# Altium schematic sheet PROTECTION.SchDoc
size A4; SheetNumber: 1; SheetTotal: 4
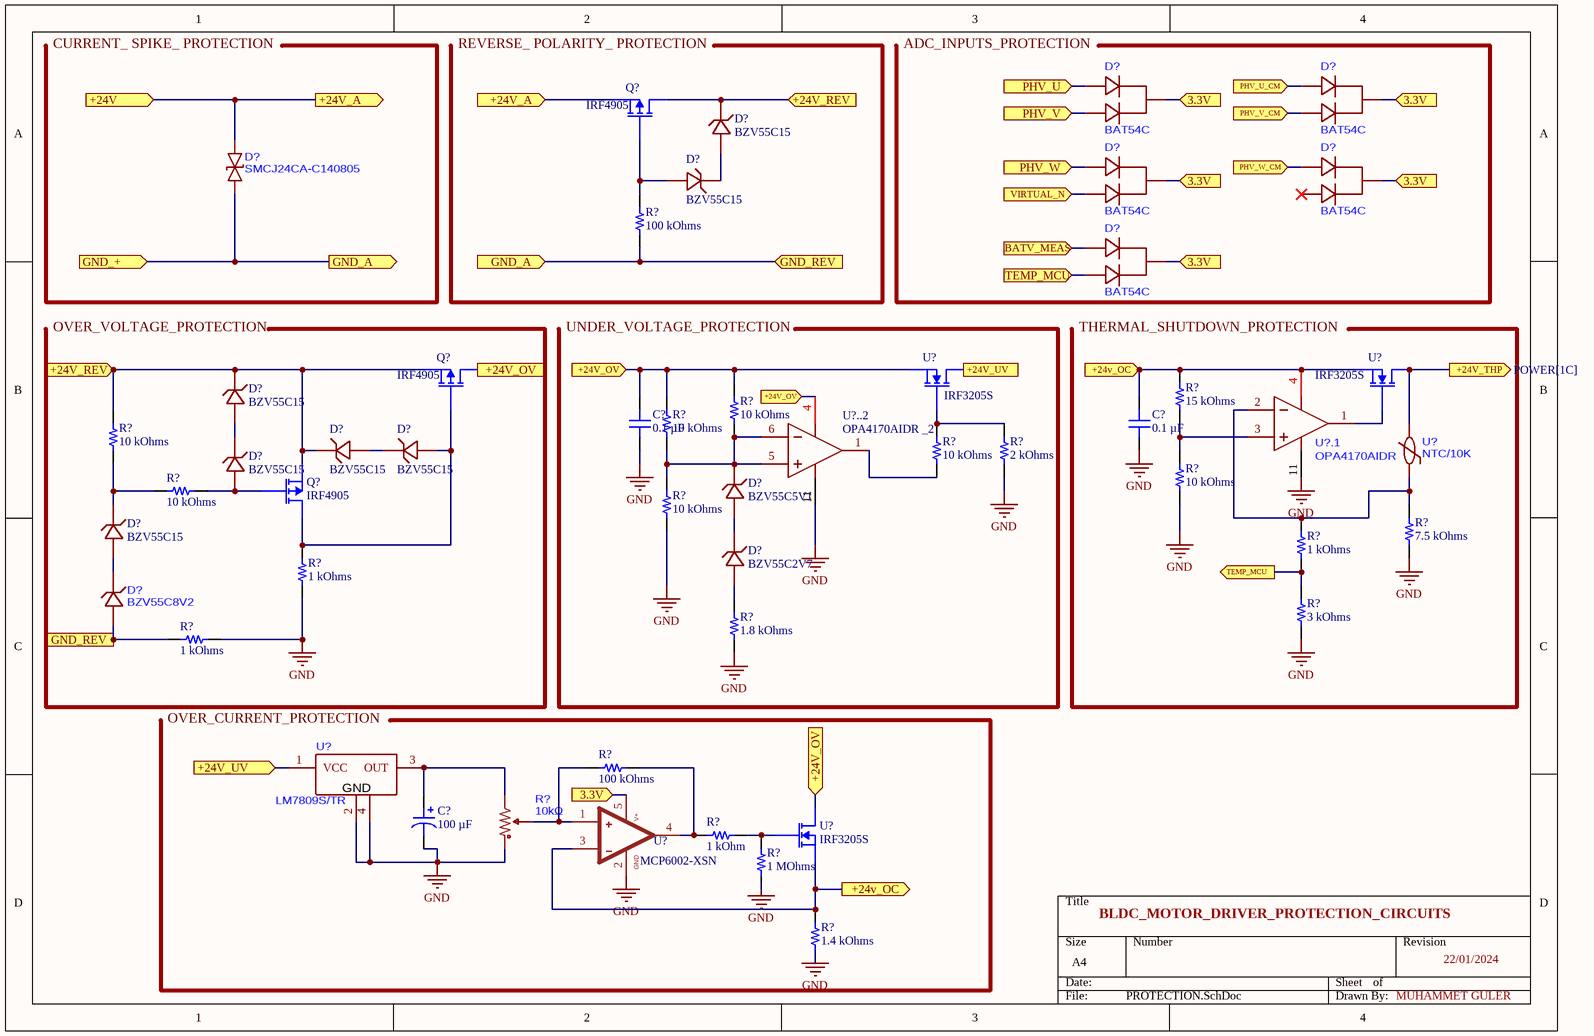
[diagram p0: PROTECTION.SchDoc]

## Parts
(Parts that share a designator on the sheet are numbered #1, #2 ... from top to bottom, then left to right.)
C?#1  0.1 µF  [CAP 1210_3225 - 1MM]
C?#2  0.1 µF  [CAP 1210_3225 - 1MM]
C?#3  100 µF  [CAP ALSMD POLY 5.3MM H5.7MM]
D?#1  BAT54C  [SOT-23-3_L2.9-W1.6-P1.90-LS2.8-BR]
D?#2  BAT54C  [SOT-23-3_L2.9-W1.6-P1.90-LS2.8-BR]
D?#3  BZV55C15  [SOD-80_L3.5-W1.5-RD]
D?#4  SMCJ24CA-C140805  [SMC_L6.9-W5.9-LS7.9-BI]
D?#5  BZV55C15  [SOD-80_L3.5-W1.5-RD]
D?#6  BAT54C  [SOT-23-3_L2.9-W1.6-P1.90-LS2.8-BR]
D?#7  BAT54C  [SOT-23-3_L2.9-W1.6-P1.90-LS2.8-BR]
D?#8  BAT54C  [SOT-23-3_L2.9-W1.6-P1.90-LS2.8-BR]
D?#9  BZV55C15  [SOD-80_L3.5-W1.5-RD]
D?#10  BZV55C15  [SOD-80_L3.5-W1.5-RD]
D?#11  BZV55C15  [SOD-80_L3.5-W1.5-RD]
D?#12  BZV55C15  [SOD-80_L3.5-W1.5-RD]
D?#13  BZV55C5V1  [SOD-80_L3.5-W1.5-RD]
D?#14  BZV55C15  [SOD-80_L3.5-W1.5-RD]
D?#15  BZV55C2V7  [SOD-80_L3.5-W1.5-RD]
D?#16  BZV55C8V2  [SOD-80_L3.5-W1.5-RD]
Q?#1  IRF4905  [IRF4905]
Q?#2  IRF4905  [IRF4905]
Q?#3  IRF4905  [IRF4905]
R?#1  100 kOhms  [RES 1210_3225]
R?#2  15 kOhms  [RES 1210_3225]
R?#3  10 kOhms  [RES 1210_3225]
R?#4  10 kOhms  [RES 1210_3225]
R?#5  10 kOhms  [RES 1210_3225]
R?#6  10 kOhms  [RES 1210_3225]
R?#7  2 kOhms  [RES 1210_3225]
R?#8  10 kOhms  [RES 1210_3225]
R?#9  10 kOhms  [RES 1210_3225]
R?#10  10 kOhms  [RES 1210_3225]
R?#11  7.5 kOhms  [RES 1210_3225]
R?#12  1 kOhms  [RES 1210_3225]
R?#13  1 kOhms  [RES 1210_3225]
R?#14  3 kOhms  [RES 1210_3225]
R?#15  1.8 kOhms  [RES 1210_3225]
R?#16  1 kOhms  [RES 1210_3225]
R?#17  100 kOhms  [RES 1210_3225]
R?#18  10kΩ
R?#19  1 kOhm  [RES 1210_3225]
R?#20  1 MOhms  [RES 1210_3225]
R?#21  1.4 kOhms  [RES 1210_3225]
U?#1  IRF3205S  [IRF4905]
U?#2  IRF3205S  [IRF4905]
U?#3  NTC/10K  [R1210]
U?#4  LM7809S/TR  [TO-263-3_LM7809]
U?#5  MCP6002-XSN  [MSOP-8_MCP6002-XSN]
U?#6  IRF3205S  [IRF4905]
U?.1  OPA4170AIDR  [SOIC-14_OPA4170]
U?..2  OPA4170AIDR _2  [SOIC-14_OPA4170]

## Ports
3.3V (in, see DRIVER[3A], DRIVER[4B], MCU[1B], MCU[1C], MCU[1D], MCU[2A], MCU[2B], MCU[2C], MCU[2D], MCU[3A], MCU[3B], MCU[3D], MCU[4A], MCU[4C], POWER[2A], POWER[3A], POWER[3B], POWER[4A], PROTECTION[2D], PROTECTION[4A]), 3.3V (in, see DRIVER[3A], DRIVER[4B], MCU[1B], MCU[1C], MCU[1D], MCU[2A], MCU[2B], MCU[2C], MCU[2D], MCU[3A], MCU[3B], MCU[3D], MCU[4A], MCU[4C], POWER[2A], POWER[3A], POWER[3B], POWER[4A], PROTECTION[2D], PROTECTION[4A], PROTECTION[4B]), 3.3V (in, see DRIVER[3A], DRIVER[4B], MCU[1B], MCU[1C], MCU[1D], MCU[2A], MCU[2B], MCU[2C], MCU[2D], MCU[3A], MCU[3B], MCU[3D], MCU[4A], MCU[4C], POWER[2A], POWER[3A], POWER[3B], POWER[4A], PROTECTION[4A], PROTECTION[4B]), +24V (in, see POWER[4C]), +24V_A (in, see PROTECTION[1A]), +24V_A (out, see PROTECTION[2A]), +24v_OC (in, see POWER[1C], POWER[2C], PROTECTION[3D]), +24v_OC (out, see POWER[1C], POWER[2C], PROTECTION[3B]), +24V_OV (in, see PROTECTION[2B]), +24V_OV (in, see PROTECTION[2B], PROTECTION[3D]), +24V_OV (out, see PROTECTION[2B], PROTECTION[3D]), +24V_REV (in, see PROTECTION[1B]), +24V_REV (in, see PROTECTION[3A]), +24V_THP (out, see POWER[1C]), +24V_UV (in, see PROTECTION[1C]), +24V_UV (in, see PROTECTION[3B]), BATV_MEAS (in), GND_+ (in), GND_A (in, see PROTECTION[1B]), GND_A (out, see PROTECTION[2B]), GND_REV (in, see PROTECTION[1C]), GND_REV (in, see PROTECTION[2B]), PHV_U (in, see DRIVER[2A], DRIVER[3B], MCU[2B]), PHV_U_CM (in, see MCU[2B], POWER[3A]), PHV_V (in, see DRIVER[3B], DRIVER[4A], MCU[2B]), PHV_V_CM (in, see MCU[2B], POWER[3B]), PHV_W (in, see DRIVER[3B], DRIVER[4B], MCU[2B]), PHV_W_CM (in, see MCU[2B], POWER[4A]), TEMP_MCU (in, see MCU[3B], PROTECTION[4C]), TEMP_MCU (out, see MCU[3B], PROTECTION[3B]), VIRTUAL_N (in, see DRIVER[2A], DRIVER[2B], DRIVER[4A], DRIVER[4B], MCU[2B])

## Nets
GND: C?#1.2 C?#2.2 C?#3.2 R?#7.2 R?#8.2 R?#10.2 R?#11.2 R?#13.2 R?#14.2 R?#15.2 R?#16.1 R?#18.2 R?#20.2 R?#21.2 U?#4.2(GND) U?#4.4(GND) U?#5.2(GND) U?.1.11(V-) U?..2.11(V-)
3.3V: D?#1.3(K) D?#2.3(K) D?#6.3(K) D?#7.3(K) D?#8.3(K) U?#5.5(V+) ; port 3.3V
+24V: D?#4.1 Q?#1.3(S) ; port +24V, port +24V_A
+24v_OC: C?#2.1 R?#2.1 R?#21.1 U?#2.3(S) U?#5.3(-) U?#6.3(S) U?.1.4(V+) ; port +24v_OC
+24V_OV: C?#1.1 Q?#2.2(D) R?#3.1 R?#4.1 U?#1.3(S) U?#6.2(D) U?..2.4(V+) ; port +24V_OV
+24V_REV: D?#3.1(C) D?#9.1(C) D?#10.1(C) Q?#1.2(D) Q?#2.3(S) Q?#3.3(S) R?#5.1 ; port +24V_REV
+24V_THP: U?#2.2(D) U?#3.2 ; port +24V_THP
+24V_UV: U?#1.2(D) U?#4.1(VCC) ; port +24V_UV
BATV_MEAS: D?#8.1(A1) ; port BATV_MEAS
GND_+: D?#4.2 D?#16.2(A) R?#1.2 R?#16.2 ; port GND_+, port GND_A, port GND_REV
PHV_U: D?#1.1(A1) ; port PHV_U
PHV_U_CM: D?#2.1(A1) ; port PHV_U_CM
PHV_V: D?#1.2(A2) ; port PHV_V
PHV_V_CM: D?#2.2(A2) ; port PHV_V_CM
PHV_W: D?#6.1(A1) ; port PHV_W
PHV_W_CM: D?#7.1(A1) ; port PHV_W_CM
TEMP_MCU: D?#8.2(A2) R?#12.2 R?#14.1 ; port TEMP_MCU
VIRTUAL_N: D?#6.2(A2) ; port VIRTUAL_N
NetC?#3_1: C?#3.1 R?#18.1 U?#4.3(OUT)
NetD?#3_2: D?#3.2(A) D?#5.1(C)
NetD?#5_2: D?#5.2(A) Q?#1.1(G) R?#1.1
NetD?#9_2: D?#9.2(A) D?#12.1(C)
NetD?#10_2: D?#10.2(A) D?#11.1(C)
NetD?#11_2: D?#11.2(A) Q?#2.1(G) Q?#3.2(D) R?#13.1
NetD?#12_2: D?#12.2(A) Q?#3.1(G) R?#9.1
NetD?#13_1: D?#13.1(C) R?#3.2 R?#4.2 R?#10.1 U?..2.5(INB+) U?..2.6(INB-)
NetD?#13_2: D?#13.2(A) D?#15.1(C)
NetD?#14_1: D?#14.1(C) R?#5.2 R?#9.2
NetD?#14_2: D?#14.2(A) D?#16.1(C)
NetD?#15_2: D?#15.2(A) R?#15.1
NetR?#2_2: R?#2.2 R?#8.1 U?.1.3(INA+)
NetR?#6_1: R?#6.1 R?#7.1 U?#1.1(G)
NetR?#6_2: R?#6.2 U?..2.1(OUTA)
NetR?#11_1: R?#11.1 R?#12.1 U?#3.1 U?.1.2(INA-)
NetR?#17_1: R?#17.1 R?#18.3 U?#5.1(+)
NetR?#17_2: R?#17.2 R?#19.1 U?#5.4(OUT)
NetR?#19_2: R?#19.2 R?#20.1 U?#6.1(G)
NetU?#2_1: U?#2.1(G) U?.1.1(OUTA)

Not connected (* = marked no-connect by the designer): D?#7 2(A2)*

## Notes on the sheet
- CURRENT_ SPIKE_ PROTECTION
- (near Q?#1) REVERSE_ POLARITY_ PROTECTION
- ADC_INPUTS_PROTECTION
- OVER_VOLTAGE_PROTECTION
- UNDER_VOLTAGE_PROTECTION
- THERMAL_SHUTDOWN_PROTECTION
- (near U?#4) OVER_CURRENT_PROTECTION
- BLDC_MOTOR_DRIVER_PROTECTION_CIRCUITS
- 22/01/2024
- MUHAMMET GÜLER

## Library data of the parts
C?#1 C?#2 = CAN13X104KARAC7800: CAP CER 1210 0.1UF 250VAC X7R; manufacturer: KEMET; Tolerance: ±10%; Part Number: CAN13X104KARAC7800; Value: 0.1 µF; Applications: Boardflex Sensitive; Capacitance: 0.1 µF; componentlink1description: Datasheet; componentlink1url: //media.digikey.com/pdf/Data%20Sheets/Kemet%20PDFs/CAN13X104KARACTU_Spec.pdf; componentlink2description: DigiKey Link; componentlink2url: https://www.digikey.com/en/products/detail/kemet/CAN13X104KARAC7800/9962480; Device Package: 1210 (3225 Metric); Features: Soft Termination; lastupdated: 15.01.2024 20:41:47; Lifecycle Status: Active; Minimum Order: 1; Mounting Type: Surface Mount, MLCC; Operating Temperature: -55°C ~ 125°C; Package / Case: 1210 (3225 Metric); packaging: TapeAndReel; partid: 23615; Part Status: Active; price: 0.37; series: CAN SMD Indust X7R; Size / Dimension: 0.130" L x 0.102" W (3.30mm x 2.60mm); Supplier 1: DigiKey; Supplier Part Number 1: 399-20611-1-ND; Temperature Coefficient: X7R; Thickness (Max): 0.110" (2.80mm); Voltage - Rated: 250VAC
C?#3 = RFS0J101MCN1GS: CAP ALUM POLY 100UF 20% 6.3V SMD; manufacturer: Nichicon; ESR (Equivalent Series Resistance): 24mOhm; Lifetime @ Temp.: 2000 Hrs @ 105°C; Ripple Current @ High Frequency: 2.5 A @ 100 kHz; Ripple Current @ Low Frequency: 250 mA @ 120 Hz; Surface Mount Land Size: 0.209" L x 0.209" W (5.30mm x 5.30mm); Type: Polymer; Part Number: RFS0J101MCN1GS; Applications: General Purpose; Capacitance: 100 µF; componentlink1description: Datasheet; componentlink1url: http://nichicon-us.com/english/products/pdfs/e-rfs_rfa.pdf; componentlink2description: DigiKey Link; componentlink2url: https://www.digikey.com/en/products/detail/nichicon/RFS0J101MCN1GS/2202794; Device Package: Radial, Can - SMD; Height - Seated (Max): 0.224" (5.70mm); lastupdated: 13.01.2024 21:35:56; Lifecycle Status: Active; Minimum Order: 1; Mounting Type: Surface Mount; Operating Temperature: -55°C ~ 105°C; Package / Case: Radial, Can - SMD; packaging: TapeAndReel; partid: 1897; Part Status: Active; price: 0.25; series: FPCAP, RFS; Size / Dimension: 0.197" Dia (5.00mm); Supplier 1: DigiKey; Supplier Part Number 1: 493-3680-1-ND; Tolerance: ±20%; value: 100 µF; Voltage - Rated: 6.3 V
R?#1 R?#17 = RMCF1210FT100K: RES 100K OHM 1% 1/2W 1210; Manufacturer: Stackpole Electronics Inc; Power (Watts): 0.5W, 1/2W; Temperature Coefficient: ±100ppm/°C; Part Number: RMCF1210FT100K; ComponentLink1Description: Datasheet; ComponentLink1URL: https://www.seielect.com/catalog/sei-packaging.pdf; ComponentLink2Description: DigiKey Link; ComponentLink2URL: https://www.digikey.com/en/products/detail/stackpole-electronics-inc/RMCF1210FT100K/1758471; Composition: Thick Film; Device Package: 1210 (3225 Metric); Features: Automotive AEC-Q200; Height - Seated (Max): 0.028" (0.70mm); LastUpdated: 13.01.2024 21:51:14; Lifecycle Status: Active; Minimum Order: 1; Number of Terminations: 2; Operating Temperature: -55°C ~ 155°C; Package / Case: 1210 (3225 Metric); Packaging: TapeAndReel; Part Status: Active; Price: 0.01; Ratings: AEC-Q200; Resistance: 100 kOhms; Series: RMCF; Size / Dimension: 0.126" L x 0.098" W (3.20mm x 2.50mm); Supplier 1: DigiKey; Supplier Part Number 1: RMCF1210FT100KCT-ND; Supplier Device Package: 1210; Tolerance: ±1%; Value: 100 kOhms
R?#2 = CRCW121015K0FKEAHP: RES SMD 15K OHM 1% 3/4W 1210; Manufacturer: Vishay Dale; Power (Watts): 0.75W, 3/4W; Temperature Coefficient: ±100ppm/°C; Part Number: CRCW121015K0FKEAHP; ComponentLink1Description: Datasheet; ComponentLink1URL: http://www.vishay.com/docs/20043/crcwhpe3.pdf; ComponentLink2Description: DigiKey Link; ComponentLink2URL: https://www.digikey.com/en/products/detail/vishay-dale/CRCW121015K0FKEAHP/2567283; Composition: Thick Film; Device Package: 1210 (3225 Metric); Features: Automotive AEC-Q200, Pulse Withstanding; Height - Seated (Max): 0.028" (0.70mm); LastUpdated: 15.01.2024 21:47:36; Lifecycle Status: Active; Minimum Order: 1; Number of Terminations: 2; Operating Temperature: -55°C ~ 155°C; Package / Case: 1210 (3225 Metric); Packaging: TapeAndReel; Part Status: Active; Price: 0.13; Ratings: AEC-Q200; Resistance: 15 kOhms; Series: CRCW-HP; Size / Dimension: 0.126" L x 0.098" W (3.20mm x 2.50mm); Supplier 1: DigiKey; Supplier Part Number 1: 541-15.0KDCT-ND; Supplier Device Package: 1210; Tolerance: ±1%; Value: 15 kOhms
R?#3-R?#6 R?#8-R?#10 = RMCF1210FT10K0: RES 10K OHM 1% 1/2W 1210; Manufacturer: Stackpole Electronics Inc; Power (Watts): 0.5W, 1/2W; Temperature Coefficient: ±100ppm/°C; Part Number: RMCF1210FT10K0; ComponentLink1Description: Datasheet; ComponentLink1URL: https://www.seielect.com/catalog/sei-rmcf_rmcp.pdf; ComponentLink2Description: DigiKey Link; ComponentLink2URL: https://www.digikey.com/en/products/detail/stackpole-electronics-inc/RMCF1210FT10K0/1758528; Composition: Thick Film; Device Package: 1210 (3225 Metric); Features: Automotive AEC-Q200; Height - Seated (Max): 0.028" (0.70mm); Lifecycle Status: Active; Minimum Order: 1; Number of Terminations: 2; Operating Temperature: -55°C ~ 155°C; Package / Case: 1210 (3225 Metric); Packaging: TapeAndReel; Part Status: Active; Price: 0.01; Ratings: AEC-Q200; Resistance: 10 kOhms; Series: RMCF; Size / Dimension: 0.126" L x 0.098" W (3.20mm x 2.50mm); Supplier 1: DigiKey; Supplier Part Number 1: RMCF1210FT10K0CT-ND; Supplier Device Package: 1210; Tolerance: ±1%; Value: 10 kOhms
  R?#3 R?#4 R?#6 R?#10: LastUpdated: 16.01.2024 21:51:52
  R?#5 R?#9: LastUpdated: 13.01.2024 21:51:22
  R?#8: LastUpdated: 15.01.2024 21:47:42
R?#7 = RT1210BRD072KL: RES SMD 2K OHM 0.1% 1/4W 1210; Manufacturer: Yageo; Power (Watts): 0.25W, 1/4W; Temperature Coefficient: ±25ppm/°C; Part Number: RT1210BRD072KL; ComponentLink1Description: Datasheet; ComponentLink1URL: https://www.yageo.com/upload/media/product/productsearch/datasheet/rchip/PYu-RT_1-to-0.01_RoHS_L_11.pdf; ComponentLink2Description: DigiKey Link; ComponentLink2URL: https://www.digikey.com/en/products/detail/yageo/RT1210BRD072KL/5138742; Composition: Thin Film; Device Package: 1210 (3225 Metric); Height - Seated (Max): 0.026" (0.65mm); LastUpdated: 16.01.2024 21:51:50; Lifecycle Status: Active; Minimum Order: 1; Number of Terminations: 2; Operating Temperature: -55°C ~ 125°C; Package / Case: 1210 (3225 Metric); Packaging: TapeAndReel; Part Status: Active; Price: 0.20; Resistance: 2 kOhms; Series: RT; Size / Dimension: 0.122" L x 0.102" W (3.10mm x 2.60mm); Supplier 1: DigiKey; Supplier Part Number 1: YAG2223CT-ND; Supplier Device Package: 1210; Tolerance: ±0.1%; Value: 2 kOhms
R?#11 = ERJ-P14J752U: RES SMD 7.5K OHM 5% 1/2W 1210; Manufacturer: Panasonic Electronic Components; Power (Watts): 0.5W, 1/2W; Temperature Coefficient: ±200ppm/°C; Part Number: ERJ-P14J752U; ComponentLink1Description: Datasheet; ComponentLink1URL: https://industrial.panasonic.com/cdbs/www-data/pdf/RDO0000/AOA0000C331.pdf; ComponentLink2Description: DigiKey Link; ComponentLink2URL: https://www.digikey.com/en/products/detail/panasonic-electronic-components/ERJ-P14J752U/570476; Composition: Thick Film; Device Package: 1210 (3225 Metric); Features: Automotive AEC-Q200, Pulse Withstanding; Height - Seated (Max): 0.028" (0.70mm); LastUpdated: 15.01.2024 21:47:38; Lifecycle Status: Active; Minimum Order: 1; Number of Terminations: 2; Operating Temperature: -55°C ~ 155°C; Package / Case: 1210 (3225 Metric); Packaging: TapeAndReel; Part Status: Active; Price: 0.02; Ratings: AEC-Q200; Resistance: 7.5 kOhms; Series: ERJ-P14; Size / Dimension: 0.126" L x 0.098" W (3.20mm x 2.50mm); Supplier 1: DigiKey; Supplier Part Number 1: P7.5KASCT-ND; Supplier Device Package: 1210; Tolerance: ±5%; Value: 7.5 kOhms
R?#12 = RC1210JR-071KL: RES 1K OHM 5% 1/2W 1210; Manufacturer: Yageo; Power (Watts): 0.5W, 1/2W; Temperature Coefficient: ±100ppm/°C; Part Number: RC1210JR-071KL; ComponentLink1Description: Datasheet; ComponentLink1URL: https://www.yageo.com/upload/media/product/productsearch/datasheet/rchip/PYu-RC_Group_51_RoHS_L_10.pdf; ComponentLink2Description: DigiKey Link; ComponentLink2URL: https://www.digikey.com/en/products/detail/yageo/RC1210JR-071KL/5919874; Composition: Thick Film; Device Package: 1210 (3225 Metric); Features: Moisture Resistant; Height - Seated (Max): 0.024" (0.60mm); LastUpdated: 15.01.2024 21:47:42; Lifecycle Status: Active; Minimum Order: 1; Number of Terminations: 2; Operating Temperature: -55°C ~ 155°C; Package / Case: 1210 (3225 Metric); Packaging: TapeAndReel; Part Status: Active; Price: 0.01; Resistance: 1 kOhms; Series: RC_L; Size / Dimension: 0.122" L x 0.102" W (3.10mm x 2.60mm); Supplier 1: DigiKey; Supplier Part Number 1: YAG3377CT-ND; Supplier Device Package: 1210; Tolerance: ±5%; Value: 1 kOhms
R?#13 = CRCW12101K00FKTA: RES SMD 1K OHM 1% 1/2W 1210; Manufacturer: Vishay Dale; Power (Watts): 0.5W, 1/2W; Temperature Coefficient: ±100ppm/°C; Part Number: CRCW12101K00FKTA; ComponentLink1Description: Datasheet; ComponentLink1URL: http://www.vishay.com/docs/20008/dcrcw.pdf; ComponentLink2Description: DigiKey Link; ComponentLink2URL: https://www.digikey.com/en/products/detail/vishay-dale/CRCW12101K00FKTA/1224396; Composition: Thick Film; Device Package: 1210 (3225 Metric); Features: Automotive AEC-Q200; Height - Seated (Max): 0.024" (0.60mm); LastUpdated: 15.01.2024 21:47:34; Lifecycle Status: Active; Minimum Order: 1; Number of Terminations: 2; Operating Temperature: -55°C ~ 155°C; Package / Case: 1210 (3225 Metric); Packaging: TapeAndReel; Part Status: Active; Price: 0.05; Ratings: AEC-Q200; Resistance: 1 kOhms; Series: CRCW; Size / Dimension: 0.126" L x 0.098" W (3.20mm x 2.50mm); Supplier 1: DigiKey; Supplier Part Number 1: 541-CRCW12101K00FKTACT-ND; Supplier Device Package: 1210; Tolerance: ±1%; Value: 1 kOhms
R?#14 = RC1210FR-073KL: RES 3K OHM 1% 1/2W 1210; Manufacturer: Yageo; Power (Watts): 0.5W, 1/2W; Temperature Coefficient: ±100ppm/°C; Part Number: RC1210FR-073KL; ComponentLink2Description: DigiKey Link; ComponentLink2URL: https://www.digikey.com/en/products/detail/yageo/RC1210FR-073KL/5919566; Composition: Thick Film; Device Package: 1210 (3225 Metric); Features: Moisture Resistant; Height - Seated (Max): 0.024" (0.60mm); LastUpdated: 15.01.2024 21:47:33; Lifecycle Status: Active; Minimum Order: 1; Number of Terminations: 2; Operating Temperature: -55°C ~ 155°C; Package / Case: 1210 (3225 Metric); Packaging: TapeAndReel; Part Status: Active; Price: 0.01; Resistance: 3 kOhms; Series: RC_L; Size / Dimension: 0.122" L x 0.102" W (3.10mm x 2.60mm); Supplier 1: DigiKey; Supplier Part Number 1: 13-RC1210FR-073KLCT-ND; Supplier Device Package: 1210; Tolerance: ±1%; Value: 3 kOhms
R?#15 = RK73B2ETTD182J: RES 1.8K OHM 5% 1/2W 1210; Manufacturer: KOA Speer Electronics, Inc.; Power (Watts): 0.5W, 1/2W; Temperature Coefficient: ±200ppm/°C; Part Number: RK73B2ETTD182J; ComponentLink1Description: Datasheet; ComponentLink1URL: http://www.koaspeer.com/catimages/Products/RK73B/RK73B.pdf; ComponentLink2Description: DigiKey Link; ComponentLink2URL: https://www.digikey.com/en/products/detail/koa-speer-electronics-inc/RK73B2ETTD182J/10314973; Composition: Thick Film; Device Package: 1210 (3225 Metric); Features: Automotive AEC-Q200; Height - Seated (Max): 0.028" (0.70mm); LastUpdated: 16.01.2024 21:51:44; Lifecycle Status: Active; Minimum Order: 1; Number of Terminations: 2; Operating Temperature: -55°C ~ 155°C; Package / Case: 1210 (3225 Metric); Packaging: TapeAndReel; Part Status: Active; Price: 0.01; Ratings: AEC-Q200; Resistance: 1.8 kOhms; Series: RK73B; Size / Dimension: 0.126" L x 0.102" W (3.20mm x 2.60mm); Supplier 1: DigiKey; Supplier Part Number 1: 2019-RK73B2ETTD182JCT-ND; Supplier Device Package: 1210; Tolerance: ±5%; Value: 1.8 kOhms
R?#16 = RMCF1210FT100K: RES 100K OHM 1% 1/2W 1210; Manufacturer: Stackpole Electronics Inc; Power (Watts): 0.5W, 1/2W; Resistance: 100 kOhms; Temperature Coefficient: ±100ppm/°C; Value: 100 kOhms; Part Number: RMCF1210FT100K; ComponentLink1Description: Datasheet; ComponentLink1URL: https://www.seielect.com/catalog/sei-packaging.pdf; ComponentLink2Description: DigiKey Link; ComponentLink2URL: https://www.digikey.com/en/products/detail/stackpole-electronics-inc/RMCF1210FT100K/1758471; Composition: Thick Film; Device Package: 1210 (3225 Metric); Features: Automotive AEC-Q200; Height - Seated (Max): 0.028" (0.70mm); LastUpdated: 13.01.2024 21:51:14; Lifecycle Status: Active; Minimum Order: 1; Number of Terminations: 2; Operating Temperature: -55°C ~ 155°C; Package / Case: 1210 (3225 Metric); Packaging: TapeAndReel; Part Status: Active; Price: 0.01; Ratings: AEC-Q200; Series: RMCF; Size / Dimension: 0.126" L x 0.098" W (3.20mm x 2.50mm); Supplier 1: DigiKey; Supplier Part Number 1: RMCF1210FT100KCT-ND; Supplier Device Package: 1210; Tolerance: ±1%
R?#18 = PS10KV50-103A3030
R?#19 = RMCF1210FT1K40: RES 1.4K OHM 1% 1/2W 1210; Manufacturer: Stackpole Electronics Inc; Power (Watts): 0.5W, 1/2W; Resistance: 1.4 kOhms; Temperature Coefficient: ±100ppm/°C; Value: 1.4 kOhms; Part Number: RMCF1210FT1K40; ComponentLink1Description: Datasheet; ComponentLink1URL: https://www.seielect.com/catalog/sei-rmcf_rmcp.pdf; ComponentLink2Description: DigiKey Link; ComponentLink2URL: https://www.digikey.com/en/products/detail/stackpole-electronics-inc/RMCF1210FT1K40/1715350; Composition: Thick Film; Device Package: 1210 (3225 Metric); Features: Automotive AEC-Q200; Height - Seated (Max): 0.028" (0.70mm); LastUpdated: 13.01.2024 21:51:14; Lifecycle Status: Active; Minimum Order: 1; Number of Terminations: 2; Operating Temperature: -55°C ~ 155°C; Package / Case: 1210 (3225 Metric); Packaging: TapeAndReel; Part Status: Active; Price: 0.01; Ratings: AEC-Q200; Series: RMCF; Size / Dimension: 0.126" L x 0.098" W (3.20mm x 2.50mm); Supplier 1: DigiKey; Supplier Part Number 1: 738-RMCF1210FT1K40CT-ND; Supplier Device Package: 1210; Tolerance: ±1%
R?#20 = TNPV12101M00DEEA: RES SMD 1M OHM 0.5% 1/3W 1210; Manufacturer: Vishay Dale; Power (Watts): 0.333W, 1/3W; Temperature Coefficient: ±25ppm/°C; Part Number: TNPV12101M00DEEA; ComponentLink1Description: Datasheet; ComponentLink1URL: http://www.vishay.com/docs/28881/tnpve3.pdf; ComponentLink2Description: DigiKey Link; ComponentLink2URL: https://www.digikey.com/en/products/detail/vishay-dale/TNPV12101M00DEEA/6570120; Composition: Thin Film; Device Package: 1210 (3225 Metric); Features: Anti-Sulfur, Automotive AEC-Q200, High Voltage, Moisture Resistant; Height - Seated (Max): 0.030" (0.75mm); LastUpdated: 13.01.2024 21:51:15; Lifecycle Status: Active; Minimum Order: 1; Number of Terminations: 2; Operating Temperature: -55°C ~ 125°C; Package / Case: 1210 (3225 Metric); Packaging: TapeAndReel; Part Status: Active; Price: 0.46; Ratings: AEC-Q200; Resistance: 1 MOhms; Series: TNPV; Size / Dimension: 0.126" L x 0.096" W (3.20mm x 2.45mm); Supplier 1: DigiKey; Supplier Part Number 1: 541-3267-1-ND; Supplier Device Package: 1210; Tolerance: ±0.5%; Value: 1 MOhms
R?#21 = RMCF1210FT1K40: RES 1.4K OHM 1% 1/2W 1210; Manufacturer: Stackpole Electronics Inc; Power (Watts): 0.5W, 1/2W; Temperature Coefficient: ±100ppm/°C; Part Number: RMCF1210FT1K40; ComponentLink1Description: Datasheet; ComponentLink1URL: https://www.seielect.com/catalog/sei-rmcf_rmcp.pdf; ComponentLink2Description: DigiKey Link; ComponentLink2URL: https://www.digikey.com/en/products/detail/stackpole-electronics-inc/RMCF1210FT1K40/1715350; Composition: Thick Film; Device Package: 1210 (3225 Metric); Features: Automotive AEC-Q200; Height - Seated (Max): 0.028" (0.70mm); LastUpdated: 13.01.2024 21:51:14; Lifecycle Status: Active; Minimum Order: 1; Number of Terminations: 2; Operating Temperature: -55°C ~ 155°C; Package / Case: 1210 (3225 Metric); Packaging: TapeAndReel; Part Status: Active; Price: 0.01; Ratings: AEC-Q200; Resistance: 1.4 kOhms; Series: RMCF; Size / Dimension: 0.126" L x 0.098" W (3.20mm x 2.50mm); Supplier 1: DigiKey; Supplier Part Number 1: 738-RMCF1210FT1K40CT-ND; Supplier Device Package: 1210; Tolerance: ±1%; Value: 1.4 kOhms